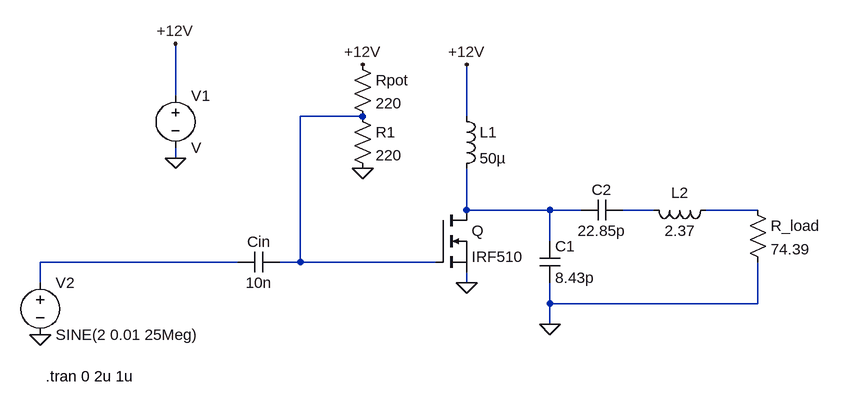
[diagram p0: schematic Class_E.asc]
Class_E.asc, the LTspice schematic file:
Version 4.1
SHEET 1 880 680
WIRE -304 -48 -304 -128
WIRE -16 -16 -112 -16
WIRE 144 -16 144 -96
WIRE -304 48 -304 32
WIRE 144 128 144 64
WIRE 272 128 144 128
WIRE 320 128 272 128
WIRE 432 128 384 128
WIRE 592 128 512 128
WIRE 272 176 272 128
WIRE -208 208 -512 208
WIRE -112 208 -112 -16
WIRE -112 208 -144 208
WIRE 96 208 -112 208
WIRE -512 240 -512 208
WIRE 144 240 144 224
WIRE 272 272 272 240
WIRE 592 272 592 208
WIRE 592 272 272 272
WIRE 272 304 272 272
FLAG -304 48 0
FLAG -304 -128 +12V
FLAG -512 320 0
FLAG 144 240 0
FLAG -16 64 0
FLAG -16 -96 +12V
FLAG 144 -96 +12V
FLAG 272 304 0
SYMBOL voltage -304 -64 R0
SYMATTR InstName V1
SYMBOL voltage -512 224 R0
WINDOW 123 0 0 Left 0
WINDOW 39 0 0 Left 0
SYMATTR InstName V2
SYMATTR Value SINE(2 0.01 25Meg)
SYMBOL cap -208 224 R270
WINDOW 0 32 32 VTop 2
WINDOW 3 0 32 VBottom 2
SYMATTR InstName Cin
SYMATTR Value 10n
SYMBOL res -32 -32 R0
SYMATTR InstName R1
SYMATTR Value 220
SYMBOL res -32 -112 R0
SYMATTR InstName Rpot
SYMATTR Value 220
SYMBOL nmos 96 128 R0
SYMATTR InstName Q
SYMATTR Value IRF510
SYMBOL ind 128 -32 R0
SYMATTR InstName L1
SYMATTR Value 50µ
SYMBOL cap 256 176 R0
SYMATTR InstName C1
SYMATTR Value 8.43p
SYMBOL cap 384 112 R90
WINDOW 0 0 32 VBottom 2
WINDOW 3 32 32 VTop 2
SYMATTR InstName C2
SYMATTR Value 22.85p
SYMBOL ind 528 112 R90
WINDOW 0 5 56 VBottom 2
WINDOW 3 32 56 VTop 2
SYMATTR InstName L2
SYMATTR Value 2.37
SYMBOL res 576 112 R0
SYMATTR InstName R_load
SYMATTR Value 74.39
TEXT -504 384 Left 2 !.tran 0 2u 1u

The netlist it stands for:
* Class_E.asc
V1 +12V 0 V
V2 N005 0 SINE(2 0.01 25Meg)
Cin N005 N001 10n
R1 N001 0 220
Rpot +12V N001 220
M§Q N002 N001 0 0 IRF510
L1 +12V N002 50µ
C1 N002 0 8.43p
C2 N003 N002 22.85p
L2 N004 N003 2.37
R_load N004 0 74.39
.model NMOS NMOS
.model PMOS PMOS
.lib standard.mos
.tran 0 2u 1u
.backanno
.end